# Altium schematic sheet EIT_Teensy_Connections.SchDoc
size A4
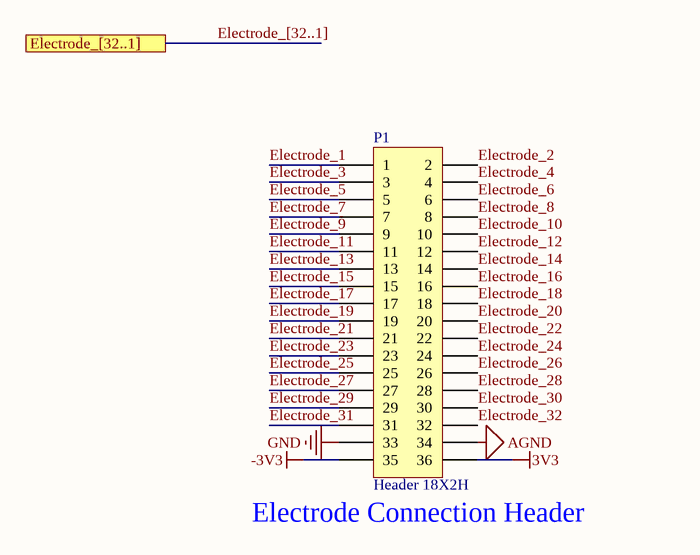
[diagram p0: EIT_Teensy_Connections.SchDoc]

## Parts
P1  Header 18X2H  [HDR2X18H]

## Ports
Electrode_[32..1]

## Nets
3V3: P1.36
-3V3: P1.35
AGND: P1.34
GND: P1.33
Electrode_1: P1.1
Electrode_2: P1.2
Electrode_3: P1.3
Electrode_4: P1.4
Electrode_5: P1.5
Electrode_6: P1.6
Electrode_7: P1.7
Electrode_8: P1.8
Electrode_9: P1.9
Electrode_10: P1.10
Electrode_11: P1.11
Electrode_12: P1.12
Electrode_13: P1.13
Electrode_14: P1.14
Electrode_15: P1.15
Electrode_16: P1.16
Electrode_17: P1.17
Electrode_18: P1.18
Electrode_19: P1.19
Electrode_20: P1.20
Electrode_21: P1.21
Electrode_22: P1.22
Electrode_23: P1.23
Electrode_24: P1.24
Electrode_25: P1.25
Electrode_26: P1.26
Electrode_27: P1.27
Electrode_28: P1.28
Electrode_29: P1.29
Electrode_30: P1.30
Electrode_31: P1.31
Electrode_32: P1.32

## Buses and harness runs
bus Electrode_[32..1] = port Electrode_[32..1]

## Notes on the sheet
- (near P1) Electrode Connection Header

## Library data of the parts
P1 = Header 18X2 2.54mm T/H R/A Male: CONN HEADER .100 DUAL R/A 36POS; Manufacturer: Sullins; Manufacturer Part Number: PRPC018DBAN-M71RC; Number of Positions: 36; Connector Type: Male Pin; Pitch: 0.1inch; Supplier 1: Digi-Key; RoHS: Yes; Category: Connectors; Pricing 1: 1=1.38000, 10=1.25200, 25=1.17480, 50=1.12380, 100=1.07280, 250=0.97060, 500=0.89398 (USD); Mount: Through Hole; Color: Black; Contact Plating: Gold; Package Quantity: 1; Number of Rows: 2; Packaging: Bulk; Termination: Solder; Series: -; Contact Type: Male Pin; Row Spacing: 0.1inch; Contact Mating Length: 0.23inch; RoHS Compliant: Yes; ComponentLink1URL: https://datasheet.ciiva.com/741/xrxczzzdxxn-m71rc-11639-b-741667.pdf?src-supplier=Digi-Key; ComponentLink1Description: https://datasheet.ciiva.com/741/xrxczzzdxxn-m71rc-11639-b-741667.pdf?src-supplier=Digi-Key; Supplier Part Number 1: S2111EC-18-ND